# EAGLE schematic color (EAGLE 7.4.0)
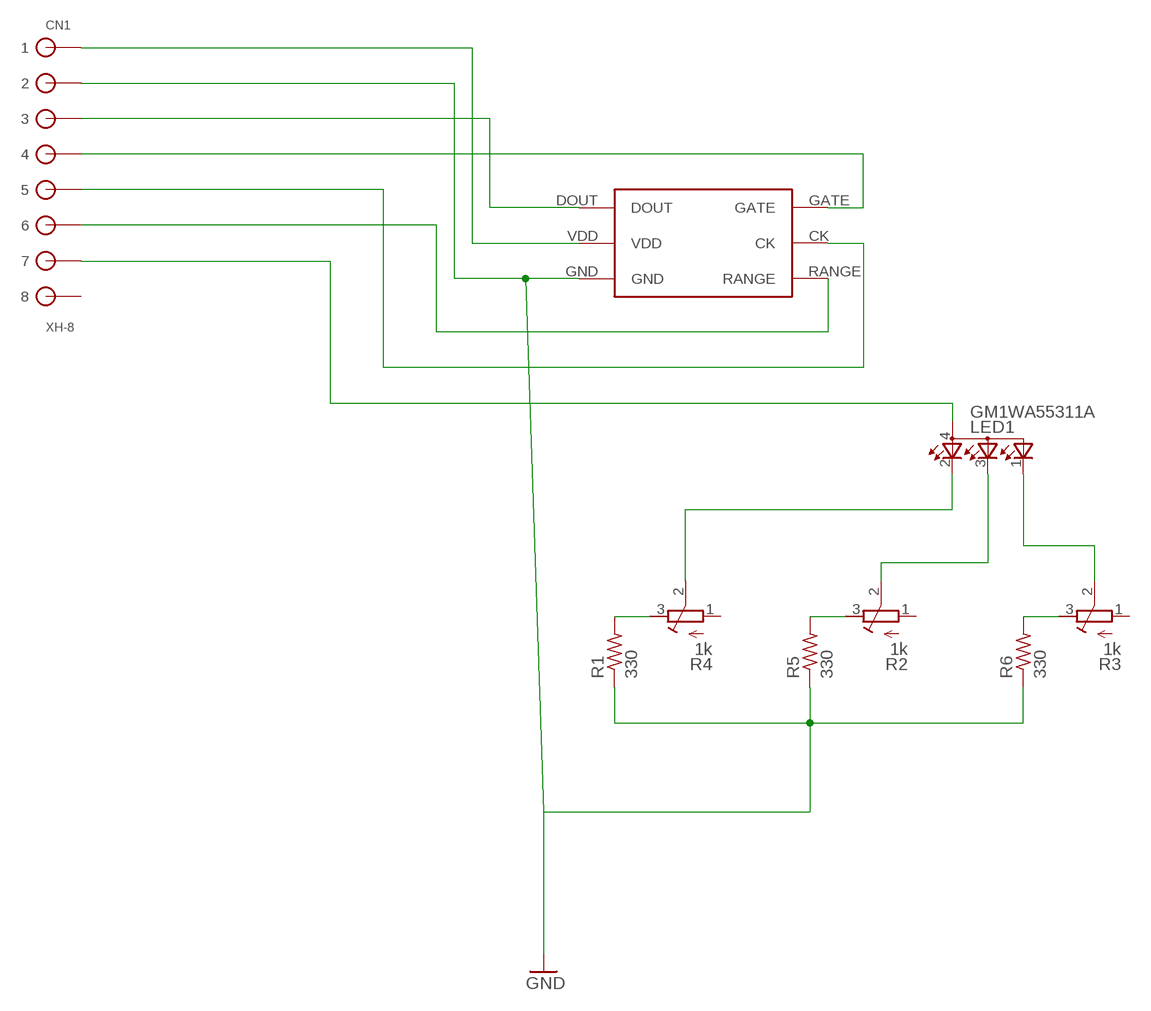
[diagram p0: schematic, sheet 1]

## Parts
CN1  XH-8  [CON8]
LED1  GM1WA55311A  [GM1WA55311A]
R1  330  R-US_R0805  [R0805]
R2  1k  R-TRIMM3339P  [RTRIM3339P]
R3  1k  R-TRIMM3339P  [RTRIM3339P]
R4  1k  R-TRIMM3339P  [RTRIM3339P]
R5  330  R-US_R0805  [R0805]
R6  330  R-US_R0805  [R0805]
U$1  S9706  [S9706]

## Nets
GND: CN1.P$2 R1.1 R5.1 R6.1 U$1.GND
N$1: R1.2 R4.3(E)
N$2: R2.3(E) R5.2
N$3: R3.3(E) R6.2
N$4: LED1.2(CRED) R4.2(S)
N$5: LED1.3(CBLUE) R2.2(S)
N$6: LED1.1(CGREEN) R3.2(S)
N$7: CN1.P$7 LED1.4(A)
N$10: CN1.P$1 U$1.VDD
N$12: CN1.P$3 U$1.DOUT
N$13: CN1.P$6 U$1.RANGE
N$14: CN1.P$5 U$1.CK
N$15: CN1.P$4 U$1.GATE
Unconnected: CN1.P$8 R2.1(A) R3.1(A) R4.1(A)

## Library data of the parts
CN1 = 0@Mylibrary-main1:XH-8: LOW INSERTION CONNECTOR 8
LED1 = led:GM1WA55311A: Chip LED RGB Source: http://document.sharpsma.com/files/GM1WA55311A_SS.pdf
R1 R5 R6 = 0@Mylibrary-main1:R-US_: RESISTOR, American symbol
R2-R4 = rcl:R-TRIMM: Trimm resistor
U$1 = S9706:S9706